# Altium schematic sheet Level_Switch_by_9013.SchDoc: Level_Switch_by_9013
size A4
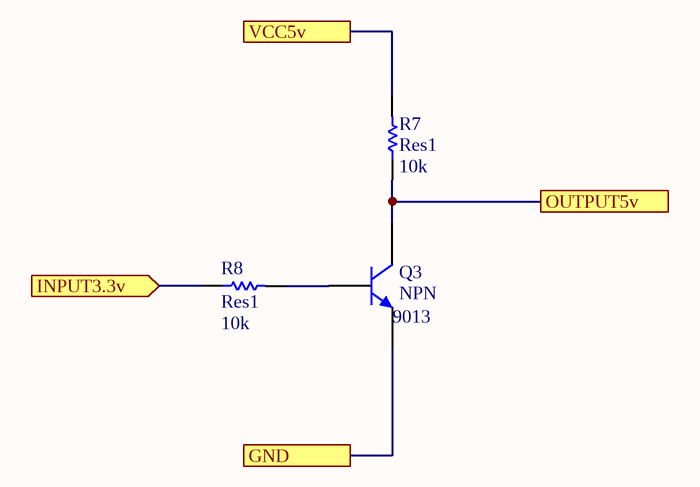
[diagram p0: Level_Switch_by_9013.SchDoc]

## Parts
Q3  NPN  name: 9013  [SOT-23]
R7  Res1  value 10k  [R0805]
R8  Res1  value 10k  [R0805]

## Ports
GND, INPUT3.3v (in), OUTPUT5v, VCC5v

## Nets
GND: Q3.3(E) ; port GND
INPUT3.3v: R8.1 ; port INPUT3.3v
OUTPUT5v: Q3.1(C) R7.1 ; port OUTPUT5v
VCC5v: R7.2 ; port VCC5v
NetQ3_2: Q3.2(B) R8.2

## Library data of the parts
Q3 = NPN: NPN Bipolar Transistor; pin to pad: 1>3 2>1 3>2; Published: 8-Jun-2000; LatestRevisionDate: 17-Jul-2002; LatestRevisionNote: Re-released for DXP Platform.; PackageReference: TO-226-AA; Publisher: Altium Limited; PackageDescription: TO, Flat Index; 3 In-Line, Axial Leads; Body Dia. 4.8mm; Leads 0.55 x 0.51 mm (max); Code_JEDEC: TO-226-AA
R7 R8 = Res1: Resistor